# Altium schematic sheet Block_diagram.SchDoc
size A3; SheetNumber: 1; SheetTotal: 1
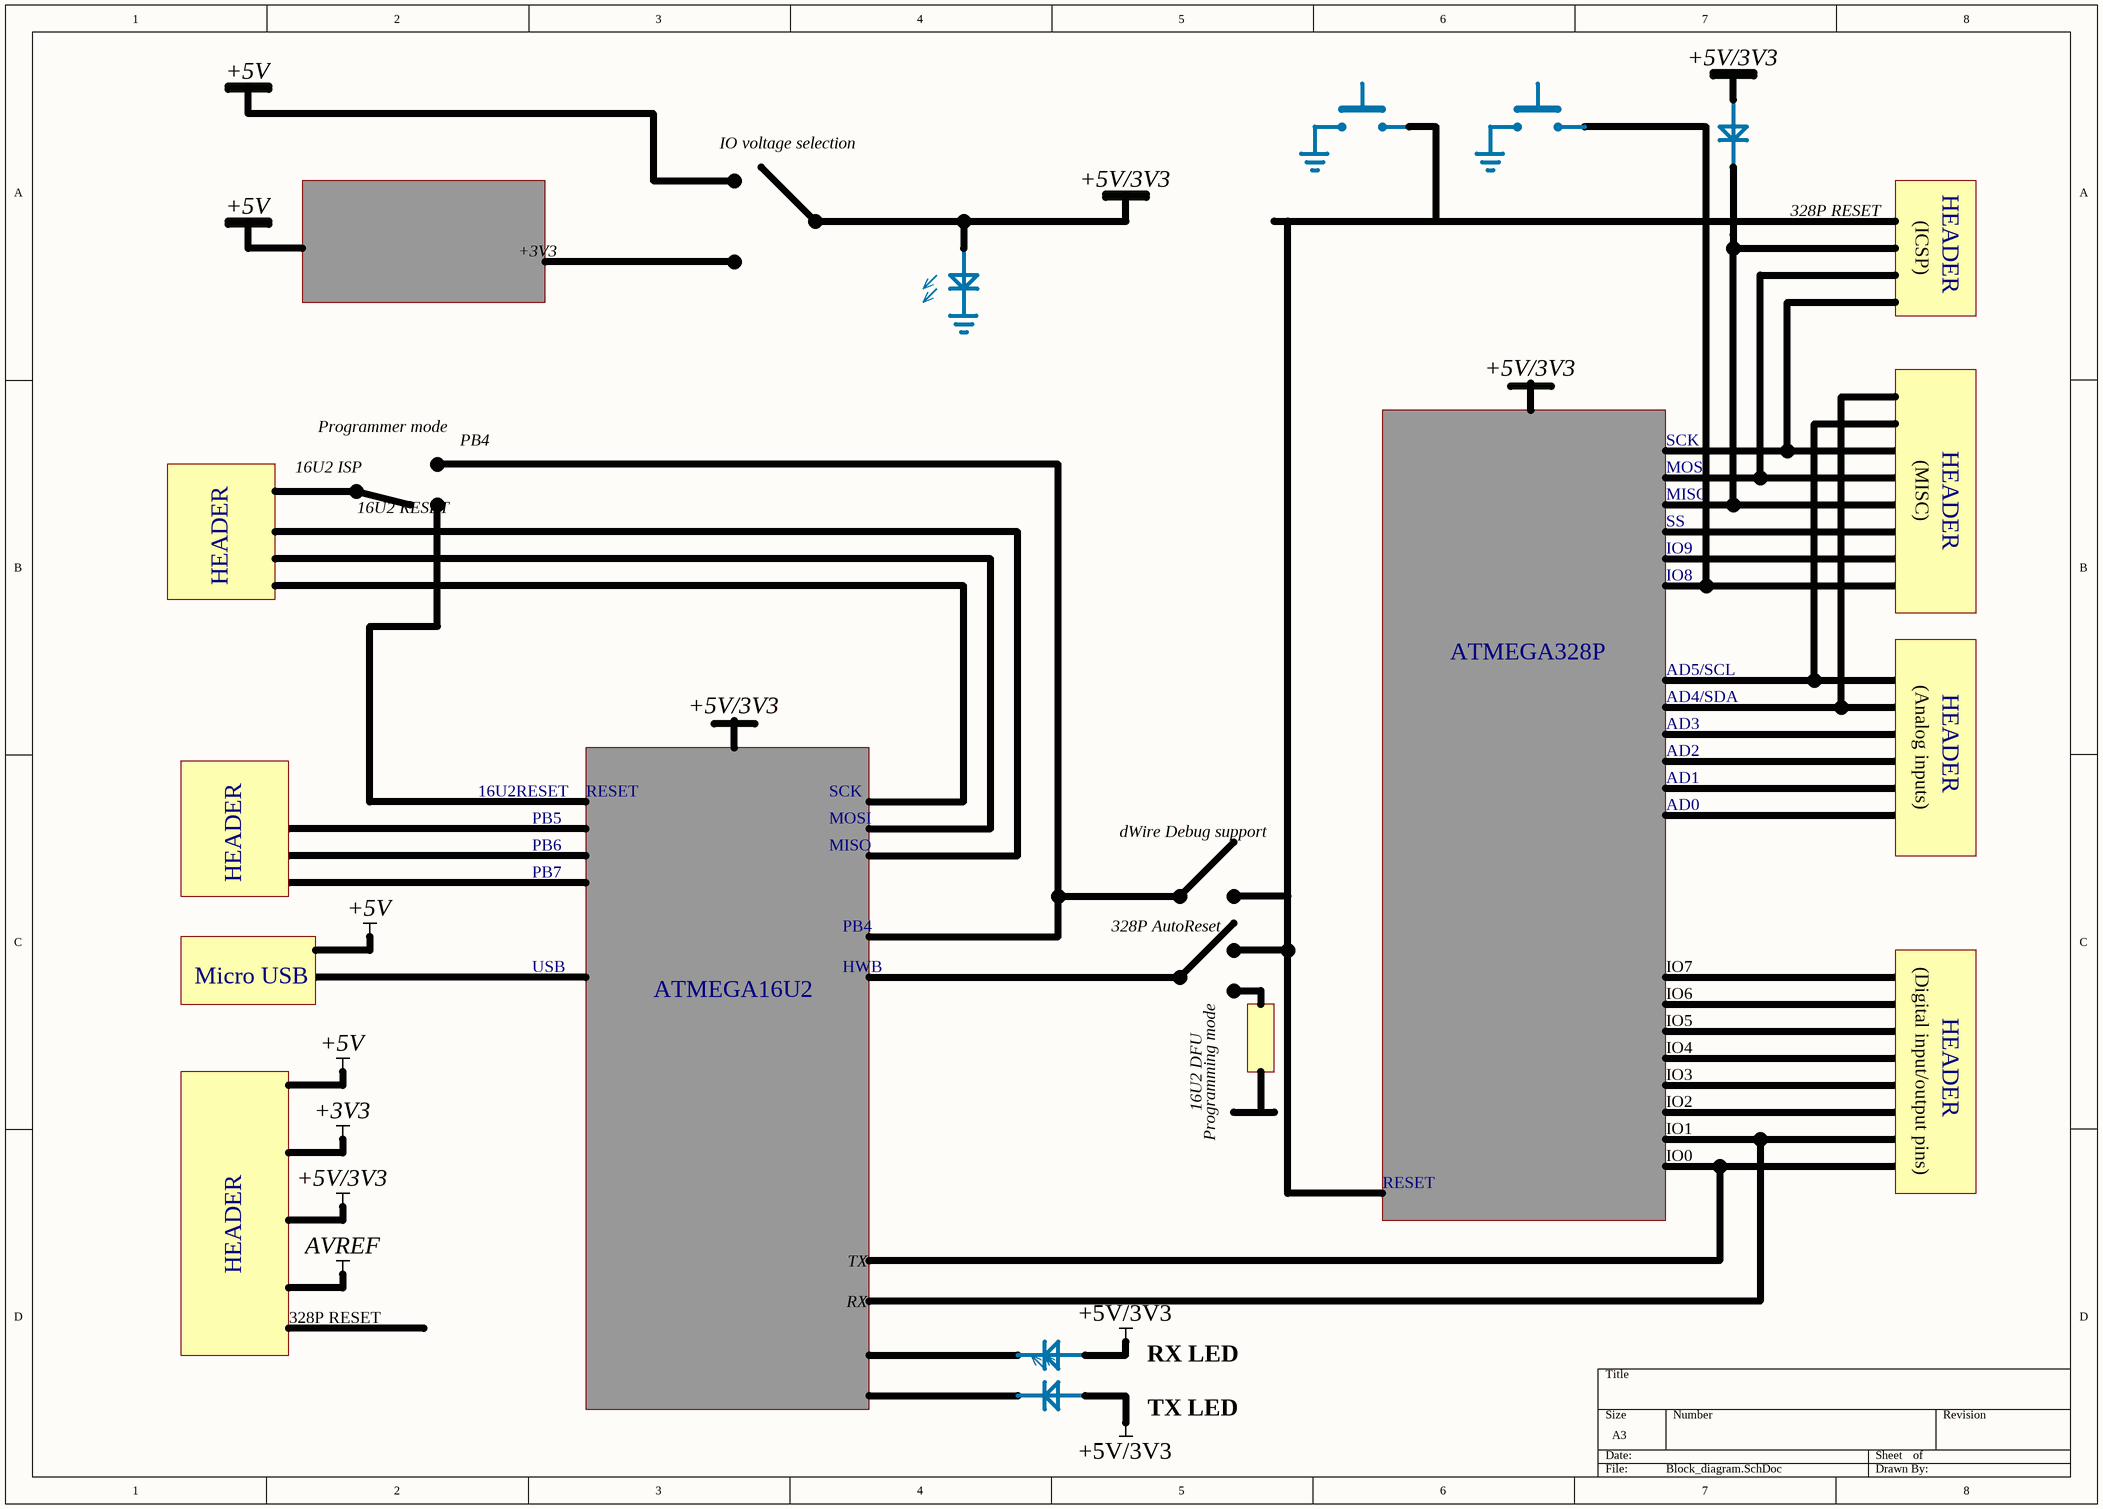
[diagram p0: Block_diagram.SchDoc]

## Notes on the sheet
- +5V
- +5V/3V3
- IO voltage selection
- 328P RESET
- (ICSP)
- HEADER
- +3V3
- Programmer mode
- PB4
- SCK
- 16U2 ISP
- 16U2 RESET
- MOSI
- MISO
- (MISC)
- IO9
- IO8
- SS
- ATMEGA328P
- AD5/SCL
- AD4/SDA
- AD3
- AD2
- AD1
- (Analog inputs)
- 16U2RESET
- PB5
- PB6
- RESET
- dWire Debug support
- AD0
- PB7
- Micro USB
- USB
- HWB
- 328P AutoReset
- IO7
- ATMEGA16U2
- IO4
- IO5
- IO6
- 16U2 DFU
- Programming mode
- IO2
- IO3
- (Digital input/output pins)
- IO0
- IO1
- TX
- RX
- RX LED
- TX LED
- Labels drawn without touching a wire or pin: +3V3, +5V, +5V/3V3, AVREF